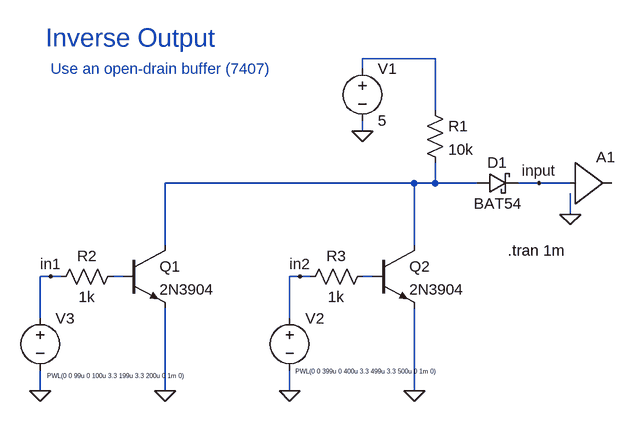
[diagram p0: schematic 01-open_collector.asc]
01-open_collector.asc, the LTspice schematic file:
Version 4
SHEET 1 880 680
WIRE 416 32 304 32
WIRE 304 48 304 32
WIRE 416 112 416 32
WIRE 304 144 304 128
WIRE 384 224 0 224
WIRE 416 224 416 192
WIRE 416 224 384 224
WIRE 480 224 416 224
WIRE 576 224 544 224
WIRE 624 224 576 224
WIRE 624 272 624 240
WIRE 0 320 0 224
WIRE 384 320 384 224
WIRE -176 368 -192 368
WIRE -160 368 -176 368
WIRE -64 368 -80 368
WIRE 208 368 192 368
WIRE 224 368 208 368
WIRE 320 368 304 368
WIRE -192 432 -192 368
WIRE 192 432 192 368
WIRE -192 544 -192 512
WIRE 0 544 0 416
WIRE 192 544 192 512
WIRE 384 544 384 416
FLAG -192 544 0
FLAG 576 224 input
FLAG 624 272 0
FLAG 304 144 0
FLAG 0 544 0
FLAG 192 544 0
FLAG 384 544 0
FLAG -176 368 in1
FLAG 208 368 in2
SYMBOL Digital\\buf1 624 160 R0
SYMATTR InstName A1
SYMBOL voltage -192 416 R0
WINDOW 123 0 0 Left 0
WINDOW 39 0 0 Left 0
WINDOW 3 11 105 Left 0
SYMATTR InstName V3
SYMATTR Value PWL(0 0 99u 0 100u 3.3 199u 3.3 200u 0 1m 0)
SYMBOL res 400 96 R0
SYMATTR InstName R1
SYMATTR Value 10k
SYMBOL schottky 480 240 R270
WINDOW 0 32 32 VTop 2
WINDOW 3 0 32 VBottom 2
SYMATTR InstName D1
SYMATTR Value BAT54
SYMATTR Description Diode
SYMATTR Type diode
SYMBOL voltage 304 32 R0
WINDOW 123 0 0 Left 0
WINDOW 39 0 0 Left 0
SYMATTR InstName V1
SYMATTR Value 5
SYMBOL res -64 352 R90
WINDOW 0 0 56 VBottom 2
WINDOW 3 32 56 VTop 2
SYMATTR InstName R2
SYMATTR Value 1k
SYMBOL npn -64 320 R0
SYMATTR InstName Q1
SYMATTR Value 2N3904
SYMBOL voltage 192 416 R0
WINDOW 123 0 0 Left 0
WINDOW 39 0 0 Left 0
WINDOW 3 9 98 Left 0
SYMATTR InstName V2
SYMATTR Value PWL(0 0 399u 0 400u 3.3 499u 3.3 500u 0 1m 0)
SYMBOL res 320 352 R90
WINDOW 0 0 56 VBottom 2
WINDOW 3 32 56 VTop 2
SYMATTR InstName R3
SYMATTR Value 1k
SYMBOL npn 320 320 R0
SYMATTR InstName Q2
SYMATTR Value 2N3904
TEXT 528 328 Left 2 !.tran 1m
TEXT -184 0 Left 4 ;Inverse Output
TEXT -176 48 Left 2 ;Use an open-drain buffer (7407)

The netlist it stands for:
* 01-open_collector.asc
A1 input 0 0 0 0 0 0 0 BUF
V3 in1 0 PWL(0 0 99u 0 100u 3.3 199u 3.3 200u 0 1m 0)
R1 N001 N002 10k
D1 N002 input BAT54
V1 N001 0 5
R2 N003 in1 1k
Q1 N002 N003 0 0 2N3904
V2 in2 0 PWL(0 0 399u 0 400u 3.3 499u 3.3 500u 0 1m 0)
R3 N004 in2 1k
Q2 N002 N004 0 0 2N3904
.model D D
.lib standard.dio
.model NPN NPN
.model PNP PNP
.lib standard.bjt
.tran 1m
* Inverse Output
* Use an open-drain buffer (7407)
.backanno
.end

* Results of the author's LTspice run, read from the files saved beside the schematic
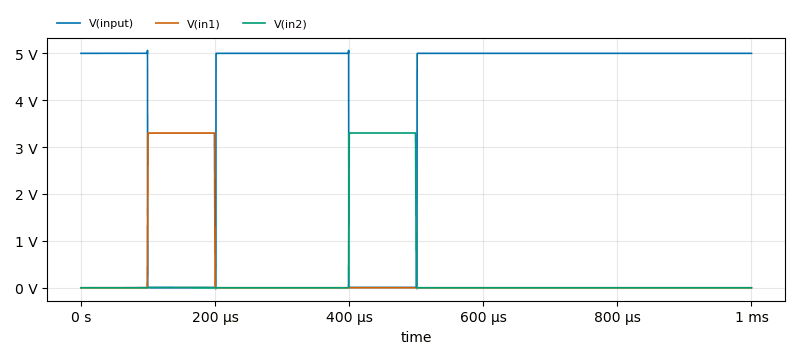
[diagram p1: Transient Analysis of 01-open_collector.asc, plotted from the saved traces]
* Transient Analysis, 1 run:
*   V(input): min -22.24 mV, max 5.064 V, average 3.982 V, rms 4.461 V, last 5 V
*   V(in1): min 0 V, max 3.3 V, average 330 mV, rms 1.042 V, last 0 V
*   V(in2): min 0 V, max 3.3 V, average 330 mV, rms 1.042 V, last 0 V